# EAGLE schematic ExpansionBoardV1 (EAGLE 7.2.0)
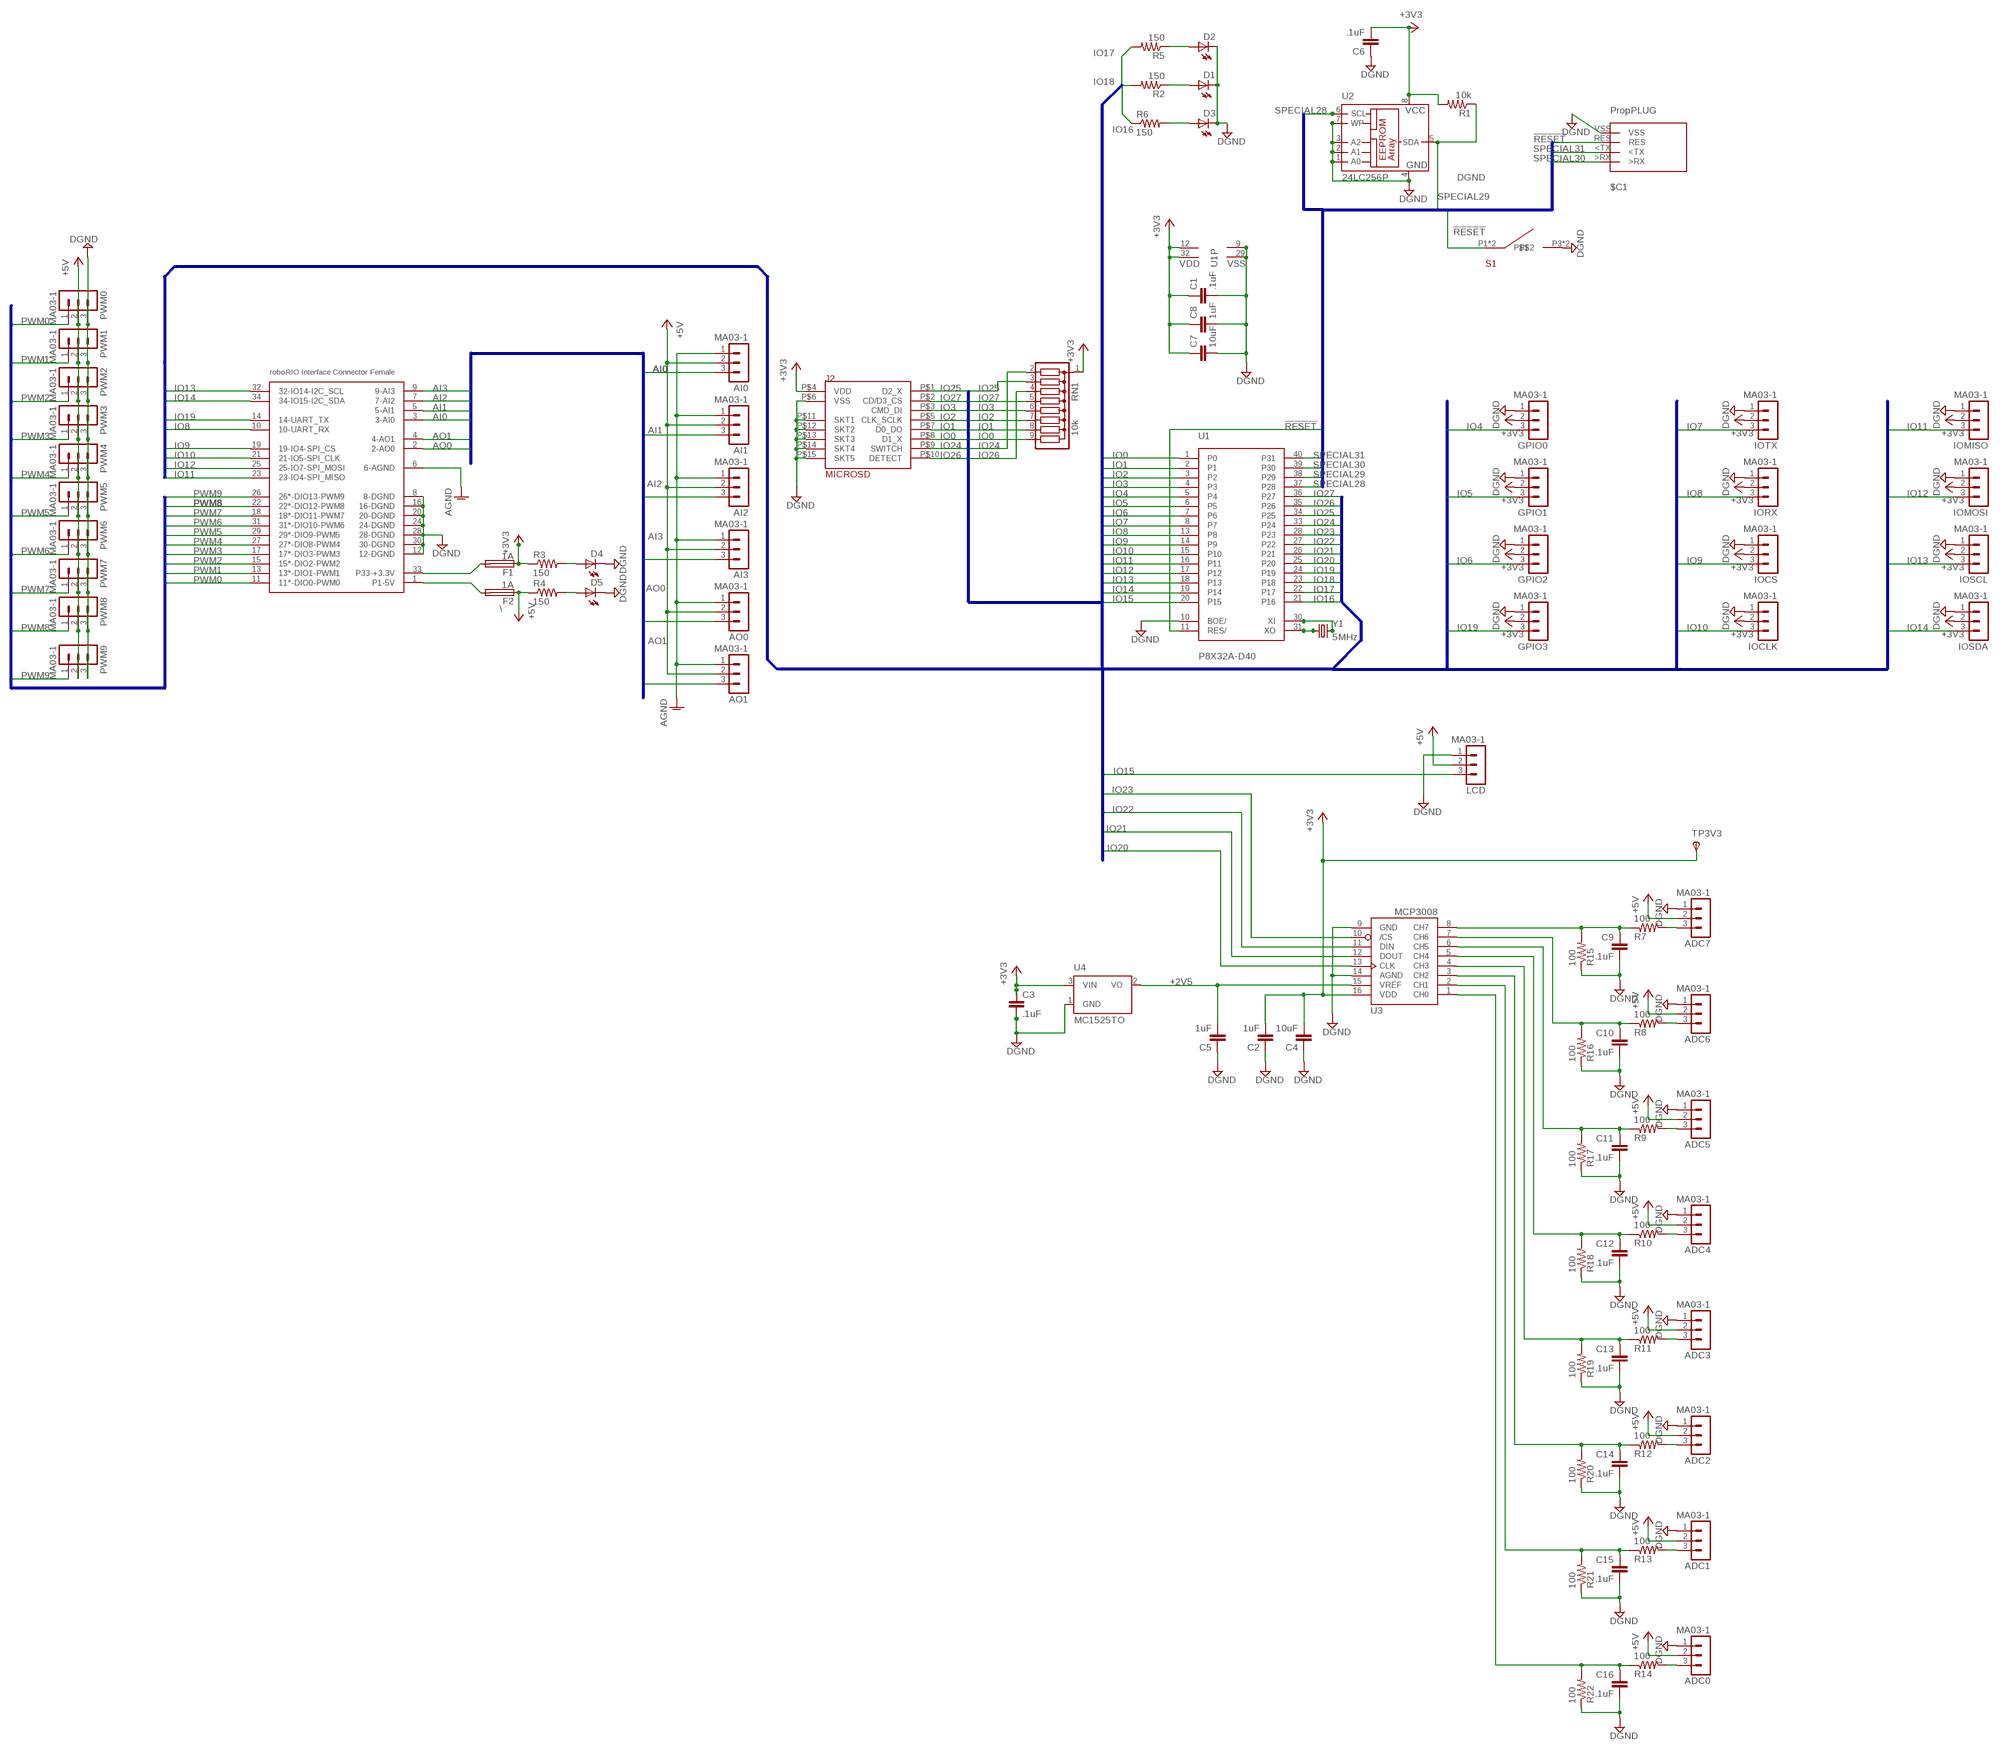
[diagram p0: schematic, sheet 1]

## Parts
ADC0  MA03-1  [MA03-1]
ADC1  MA03-1  [MA03-1]
ADC2  MA03-1  [MA03-1]
ADC3  MA03-1  [MA03-1]
ADC4  MA03-1  [MA03-1]
ADC5  MA03-1  [MA03-1]
ADC6  MA03-1  [MA03-1]
ADC7  MA03-1  [MA03-1]
AI0  MA03-1  [MA03-1]
AI1  MA03-1  [MA03-1]
AI2  MA03-1  [MA03-1]
AI3  MA03-1  [MA03-1]
AO0  MA03-1  [MA03-1]
AO1  MA03-1  [MA03-1]
C1  .1uF  C5/2.5  [C5B2.5]
C2  1uF  C5/2.5  [C5B2.5]
C3  .1uF  C5/2.5  [C5B2.5]
C4  10uF  C5/2.5  [C5B2.5]
C5  1uF  C5/2.5  [C5B2.5]
C6  .1uF  C5/2.5  [C5B2.5]
C7  10uF  C5/2.5  [C5B2.5]
C8  1uF  C5/2.5  [C5B2.5]
C9  .1uF  C5/2.5  [C5B2.5]
C10  .1uF  C5/2.5  [C5B2.5]
C11  .1uF  C5/2.5  [C5B2.5]
C12  .1uF  C5/2.5  [C5B2.5]
C13  .1uF  C5/2.5  [C5B2.5]
C14  .1uF  C5/2.5  [C5B2.5]
C15  .1uF  C5/2.5  [C5B2.5]
C16  .1uF  C5/2.5  [C5B2.5]
D1  LED5MM  [LED5MM]
D2  LED5MM  [LED5MM]
D3  LED5MM  [LED5MM]
D4  LED5MM  [LED5MM]
D5  LED5MM  [LED5MM]
F1  1A  TR5  [TR5]
F2  1A  TR5  [TR5]
GPIO0  MA03-1  [MA03-1]
GPIO1  MA03-1  [MA03-1]
GPIO2  MA03-1  [MA03-1]
GPIO3  MA03-1  [MA03-1]
IOCLK  MA03-1  [MA03-1]
IOCS  MA03-1  [MA03-1]
IOMISO  MA03-1  [MA03-1]
IOMOSI  MA03-1  [MA03-1]
IORX  MA03-1  [MA03-1]
IOSCL  MA03-1  [MA03-1]
IOSDA  MA03-1  [MA03-1]
IOTX  MA03-1  [MA03-1]
J1  RRINTERFACE-FEMALE  [RRINT-FEMALE]
J2  MICROSD  [MICRO_SD_PUSH-PUSH]
LCD  MA03-1  [MA03-1]
P1  PROP_PLUG  [PROP_PLUG]
PWM0  MA03-1  [MA03-1]
PWM1  MA03-1  [MA03-1]
PWM2  MA03-1  [MA03-1]
PWM3  MA03-1  [MA03-1]
PWM4  MA03-1  [MA03-1]
PWM5  MA03-1  [MA03-1]
PWM6  MA03-1  [MA03-1]
PWM7  MA03-1  [MA03-1]
PWM8  MA03-1  [MA03-1]
PWM9  MA03-1  [MA03-1]
R1  10k  R-US_0204/7  [0204/7]
R2  150  R-US_0204/7  [0204/7]
R3  150  R-US_0204/7  [0204/7]
R4  150  R-US_0204/7  [0204/7]
R5  150  R-US_0204/7  [0204/7]
R6  150  R-US_0204/7  [0204/7]
R7  100  R-US_0204/7  [0204/7]
R8  100  R-US_0204/7  [0204/7]
R9  100  R-US_0204/7  [0204/7]
R10  100  R-US_0204/7  [0204/7]
R11  100  R-US_0204/7  [0204/7]
R12  100  R-US_0204/7  [0204/7]
R13  100  R-US_0204/7  [0204/7]
R14  100  R-US_0204/7  [0204/7]
R15  100  R-US_0204/7  [0204/7]
R16  100  R-US_0204/7  [0204/7]
R17  100  R-US_0204/7  [0204/7]
R18  100  R-US_0204/7  [0204/7]
R19  100  R-US_0204/7  [0204/7]
R20  100  R-US_0204/7  [0204/7]
R21  100  R-US_0204/7  [0204/7]
R22  100  R-US_0204/7  [0204/7]
RN1  10k  G08R  [SIL9]
S1  BUTTON  [RESETBUTTON300000MILLION]
TP3V3  TPSPAD1-13  [P1-13]
U1  P8X32A-D40  [P8X32A-D40]
U2  24LC256P  [DIL8]
U3  MCP3008  [DIL16]
U4  MC1525TO  [TO92]
Y1  5MHz  CRYSTALHC49U70  [HC49U70]

## Nets
!RESET: P1.RES S1.P1 S1.P2 U1.11(RES/)
+2V5: C5.2 U3.15(VREF) U4.2(VO)
+3V3: C1.1 C2.2 C3.1 C4.2 C6.2 C7.1 C8.1 F1.1 GPIO0.2 GPIO1.2 GPIO2.2 GPIO3.2 IOCLK.2 IOCS.2 IOMISO.2 IOMOSI.2 IORX.2 IOSCL.2 IOSDA.2 IOTX.2 J2.P$4(VDD) R1.2 R3.1 RN1.1 TP3V3.TP(PP) U1.12(VDD) U1.32(VDD) U2.8(VCC) U3.16(VDD) U4.3(VIN)
+5V: ADC0.2 ADC1.2 ADC2.2 ADC3.2 ADC4.2 ADC5.2 ADC6.2 ADC7.2 AI0.2 AI1.2 AI2.2 AI3.2 AO0.2 AO1.2 F2.1 LCD.2 PWM0.2 PWM1.2 PWM2.2 PWM3.2 PWM4.2 PWM5.2 PWM6.2 PWM7.2 PWM8.2 PWM9.2 R4.1
AGND: AI0.1 AI1.1 AI2.1 AI3.1 AO0.1 AO1.1 J1.6(6-AGND)
AI0: AI0.3 J1.3(3-AI0)
AI1: AI1.3 J1.5(5-AI1)
AI2: AI2.3 J1.7(7-AI2)
AI3: AI3.3 J1.9(9-AI3)
AO0: AO0.3 J1.2(2-AO0)
AO1: AO1.3 J1.4(4-AO1)
DGND: ADC0.1 ADC1.1 ADC2.1 ADC3.1 ADC4.1 ADC5.1 ADC6.1 ADC7.1 C1.2 C2.1 C3.2 C4.1 C5.1 C6.1 C7.2 C8.2 C9.2 C10.2 C11.2 C12.2 C13.2 C14.2 C15.2 C16.2 D1.K(C) D2.K(C) D3.K(C) D4.K(C) D5.K(C) GPIO0.1 GPIO1.1 GPIO2.1 GPIO3.1 IOCLK.1 IOCS.1 IOMISO.1 IOMOSI.1 IORX.1 IOSCL.1 IOSDA.1 IOTX.1 J1.8(8-DGND) J1.12(12-DGND) J1.16(16-DGND) J1.20(20-DGND) J1.24(24-DGND) J1.28(28-DGND) J1.30(30-DGND) J2.P$6(VSS) J2.P$11(SKT1) J2.P$12(SKT2) J2.P$13(SKT3) J2.P$14(SKT4) J2.P$15(SKT5) LCD.1 P1.VSS PWM0.3 PWM1.3 PWM2.3 PWM3.3 PWM4.3 PWM5.3 PWM6.3 PWM7.3 PWM8.3 PWM9.3 R15.1 R16.1 R17.1 R18.1 R19.1 R20.1 R21.1 R22.1 S1.P3 S1.P4 U1.9(VSS) U1.10(BOE/) U1.29(VSS) U2.1(A0) U2.2(A1) U2.3(A2) U2.4(GND) U2.7(WP) U3.9(GND) U3.14(AGND) U4.1(GND)
IO0: J2.P$8(D1_X) RN1.9 U1.1(P0)
IO1: J2.P$7(D0_DO) RN1.8 U1.2(P1)
IO2: J2.P$5(CLK_SCLK) RN1.7 U1.3(P2)
IO3: J2.P$3(CMD_DI) RN1.6 U1.4(P3)
IO4: GPIO0.3 U1.5(P4)
IO5: GPIO1.3 U1.6(P5)
IO6: GPIO2.3 U1.7(P6)
IO7: IOTX.3 U1.8(P7)
IO8: IORX.3 J1.10(10-UART_RX) U1.13(P8)
IO9: IOCS.3 J1.19(19-IO4-SPI_CS) U1.14(P9)
IO10: IOCLK.3 J1.21(21-IO5-SPI_CLK) U1.15(P10)
IO11: IOMISO.3 J1.23(23-IO4-SPI_MISO) U1.16(P11)
IO12: IOMOSI.3 J1.25(25-IO7-SPI_MOSI) U1.17(P12)
IO13: IOSCL.3 J1.32(32-IO14-I2C_SCL) U1.18(P13)
IO14: IOSDA.3 J1.34(34-IO15-I2C_SDA) U1.19(P14)
IO15: LCD.3 U1.20(P15)
IO16: R6.1 U1.21(P16)
IO17: R5.2 U1.22(P17)
IO18: R2.2 U1.23(P18)
IO19: GPIO3.3 J1.14(14-UART_TX) U1.24(P19)
IO20: U1.25(P20) U3.13(CLK)
IO21: U1.26(P21) U3.12(DOUT)
IO22: U1.27(P22) U3.11(DIN)
IO23: U1.28(P23) U3.10(/CS)
IO24: J2.P$9(SWITCH) RN1.2 U1.33(P24)
IO25: J2.P$1(D2_X) RN1.3 U1.34(P25)
IO26: J2.P$10(DETECT) RN1.4 U1.35(P26)
IO27: J2.P$2(CD/D3_CS) RN1.5 U1.36(P27)
L1: D4.A R3.2
N$1: U1.31(XO) Y1.1
N$2: U1.30(XI) Y1.2
N$4: D5.A R4.2
N$5: F1.2 J1.33(P33-+3.3V)
N$7: ADC1.3 R13.2
N$8: C16.1 R14.1 R22.2 U3.1(CH0)
N$9: C15.1 R13.1 R21.2 U3.2(CH1)
N$10: C13.1 R11.1 R19.2 U3.4(CH3)
N$12: D3.A R6.2
N$13: D1.A R2.1
N$14: D2.A R5.1
N$15: F2.2 J1.1(P1-5V)
N$16: C14.1 R12.1 R20.2 U3.3(CH2)
N$17: C12.1 R10.1 R18.2 U3.5(CH4)
N$22: ADC2.3 R12.2
N$25: ADC3.3 R11.2
N$29: ADC4.3 R10.2
N$30: C11.1 R9.1 R17.2 U3.6(CH5)
N$31: ADC5.3 R9.2
N$33: ADC0.3 R14.2
N$34: C9.1 R7.1 R15.2 U3.8(CH7)
N$35: ADC6.3 R8.2
N$36: ADC7.3 R7.2
N$40: C10.1 R8.1 R16.2 U3.7(CH6)
PWM0: J1.11(11*-DIO0-PWM0) PWM0.1
PWM1: J1.13(13*-DIO1-PWM1) PWM1.1
PWM2: J1.15(15*-DIO2-PWM2) PWM2.1
PWM3: J1.17(17*-DIO3-PWM3) PWM3.1
PWM4: J1.27(27*-DIO8-PWM4) PWM4.1
PWM5: J1.29(29*-DIO9-PWM5) PWM5.1
PWM6: J1.31(31*-DIO10-PWM6) PWM6.1
PWM7: J1.18(18*-DIO11-PWM7) PWM7.1
PWM8: J1.22(22*-DIO12-PWM8) PWM8.1
PWM9: J1.26(26*-DIO13-PWM9) PWM9.1
SPECIAL28: U1.37(P28) U2.6(SCL)
SPECIAL29: R1.1 U1.38(P29) U2.5(SDA)
SPECIAL30: P1.>RX U1.39(P30)
SPECIAL31: P1.<TX U1.40(P31)

## Buses
SPECIAL[28..31],!RESET
IO[0..31],UART_TX,UART_RX,I2C_SCL,I2C_SDA
IO[0..31],AI[0..3],AO[0..1],DIO[0..3],DIO[8..13],UART_TX,UART_RX,IO0,I2C_SCL,I2C_SDA
PWM[0..9]

## Notes on the sheet
- \

## Library data of the parts
ADC0 ADC1-ADC7 AI0 AI1-AI3 AO0 AO1 GPIO0 GPIO1-GPIO3 IOCLK IOCS IOMISO IOMOSI IORX IOSCL IOSDA IOTX LCD PWM0 PWM1-PWM9 = con-lstb-modified:MA03-1: PIN HEADER; OC_FARNELL: unknown; OC_NEWARK: unknown
C1-C16 = capacitor-wima:C: CAPACITOR naming: grid - package width
D1-D5 = led:LED: LED OSRAM: - CHIPLED LG R971, LG N971, LY N971, LG Q971, LY Q971, LO R971, LY R971 LH N974, LH R974 LS Q976, LO Q976, LY Q976 LO Q996 - Hyper CHIPLED LW Q18S LB Q993, LB Q99A, LB R99A - SideLED LS A670, LO A670, LY A670, LG A670, LP A670 LB A673, LV A673, LT A673, LW A673 LH A674 LY A675 LS A676, LA A676, LO A676, LY A676, LW A676 LS A679, LY A679, LG A679 - Hyper Micro SIDELED® LS Y876, LA Y876, LO Y876, LY Y876 LT Y87S - SmartLED LW L88C, LW L88S LB L89C, LB L89S, LG L890 LS L89K, LO L89K, LY L89K LS L896, LA L896, LO L896, LY L896 - TOPLED LS T670, LO T670, LY T670, LG T670, LP T670 LSG T670, LSP T670, LSY T670, LOP T670, LYG T670 LG T671, LOG T671, LSG T671 LB T673, LV T673, LT T673, LW T673 LH T674 LS T676, LA T676, LO T676, LY T676, LB T676, LH T676, LSB T676, LW T676 LB T67C, LV T67C, LT T67C, LS T67K, LO T67K, LY T67K, LW E67C LS E67B, LA E67B, LO E67B, LY E67B, LB E67C, LV E67C, LT E67C LW T67C LS T679, LY T679, LG T679 LS T770, LO T770, LY T770, LG T770, LP T770 LB T773, LV T773, LT T773, LW T773 LH T774 LS E675, LA E675, LY E675, LS T675 LS T776, LA T776, LO T776, LY T776, LB T776 LHGB T686 LT T68C, LB T68C - Hyper Mini TOPLED® LB M676 - Mini TOPLED Santana® LG M470 LS M47K, LO M47K, LY M47K Source: http://www.osram.convergy.de LUXEON: - LUMILED® LXK2-PW12-R00, LXK2-PW12-S00, LXK2-PW14-U00, LXK2-PW14-V00 LXK2-PM12-R00, LXK2-PM12-S00, LXK2-PM14-U00 LXK2-PE12-Q00, LXK2-PE12-R00, LXK2-PE12-S00, LXK2-PE14-T00, LXK2-PE14-U00 LXK2-PB12-K00, LXK2-PB12-L00, LXK2-PB12-M00, LXK2-PB14-N00, LXK2-PB14-P00, LXK2-PB14-Q00 LXK2-PR12-L00, LXK2-PR12-M00, LXK2-PR14-Q00, LXK2-PR14-R00 LXK2-PD12-Q00, LXK2-PD12-R00, LXK2-PD12-S00 LXK2-PH12-R00, LXK2-PH12-S00 LXK2-PL12-P00, LXK2-PL12-Q00, LXK2-PL12-R00 Source: www.luxeon.com KINGBRIGHT: KA-3528ASYC Source: www.kingbright.com
F1 F2 = fuse:TR5: FUSE Wickmann; OC_FARNELL: unknown; OC_NEWARK: unknown
J1 = RoboRioConnector:RRINTERFACE-FEMALE
J2 = MicroSdSocket:MICROSD
P1 = PropPlug:PROP_PLUG: Propeller Plug This is a simple Propeller Plug (PropPLUG) design.
R1-R22 = resistor:R-US_: RESISTOR, American symbol
RN1 = resistor-sil:G08R: SIL RESISTOR; OC_FARNELL: unknown; OC_NEWARK: unknown
S1 = RESETBUTTON3000:BUTTON
TP3V3 = testpad:TPS: TEST PIN
U1 = parallax_propeller (1):P8X32A-D40
U2 = microchip:24*: Serial EEPROM I2C; MF: MICROCHIP; MPN: 24LC256-E/P; OC_FARNELL: 9757970; OC_NEWARK: 92C7169
U3 = adafruit:MCP3008
U4 = microchip:MC15*: 2.5V and 4.096V Voltage References Source: http://www.microchip.com .. 21653b.pdf; OC_FARNELL: unknown; OC_NEWARK: unknown
Y1 = crystal:CRYSTAL: CRYSTAL; OC_FARNELL: unknown; OC_NEWARK: unknown